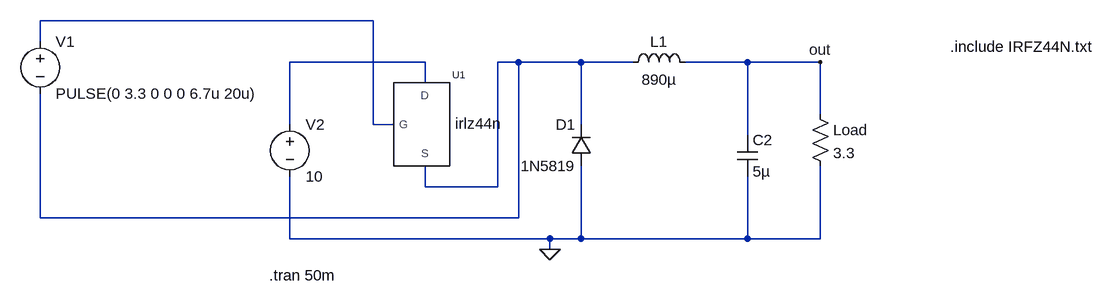
[diagram p0: schematic Buck_Converter.asc]
Buck_Converter.asc, the LTspice schematic file:
Version 4.1
SHEET 1 1204 680
WIRE -64 -64 -576 -64
WIRE -576 -32 -576 -64
WIRE 16 0 -192 0
WIRE 160 0 128 0
WIRE 256 0 160 0
WIRE 336 0 256 0
WIRE 512 0 416 0
WIRE 624 0 512 0
WIRE 16 32 16 0
WIRE 624 80 624 0
WIRE -192 96 -192 0
WIRE -64 96 -64 -64
WIRE -32 96 -64 96
WIRE 256 96 256 0
WIRE 512 112 512 0
WIRE 16 192 16 160
WIRE 128 192 128 0
WIRE 128 192 16 192
WIRE -576 240 -576 48
WIRE 160 240 160 0
WIRE 160 240 -576 240
WIRE -192 272 -192 176
WIRE 208 272 -192 272
WIRE 256 272 256 160
WIRE 256 272 208 272
WIRE 512 272 512 176
WIRE 512 272 256 272
WIRE 624 272 624 160
WIRE 624 272 512 272
WIRE 208 288 208 272
FLAG 624 0 out
FLAG 208 288 0
SYMBOL ind 320 16 R270
WINDOW 0 32 56 VTop 2
WINDOW 3 5 56 VBottom 2
SYMATTR InstName L1
SYMATTR Value 890µ
SYMBOL cap 496 112 R0
SYMATTR InstName C2
SYMATTR Value 5µ
SYMBOL voltage -192 80 R0
WINDOW 123 0 0 Left 0
WINDOW 39 0 0 Left 0
SYMATTR InstName V2
SYMATTR Value 10
SYMBOL IRZ 176 128 R0
SYMATTR InstName U1
SYMBOL voltage -576 -48 R0
WINDOW 123 0 0 Left 0
WINDOW 39 0 0 Left 0
SYMATTR InstName V1
SYMATTR Value PULSE(0 3.3 0 0 0 6.7u 20u)
SYMBOL diode 272 160 R180
WINDOW 0 24 64 Left 2
WINDOW 3 24 0 Left 2
SYMATTR InstName D1
SYMATTR Value 1N5819
SYMBOL res 608 64 R0
SYMATTR InstName Load
SYMATTR Value 3.3
TEXT -224 328 Left 2 !.tran 50m
TEXT 824 -24 Left 2 !.include IRFZ44N.txt

The netlist it stands for:
* Buck_Converter.asc
L1 N003 out 890µ
C2 out 0 5µ
V2 N002 0 10
X§U1 N002 N001 N003 irlz44n  ; pins D G S
V1 N001 N003 PULSE(0 3.3 0 0 0 6.7u 20u)
D1 0 N003 1N5819
R§Load out 0 3.3
.model D D
.lib standard.dio
.tran 50m
.include IRFZ44N.txt
.backanno
.end